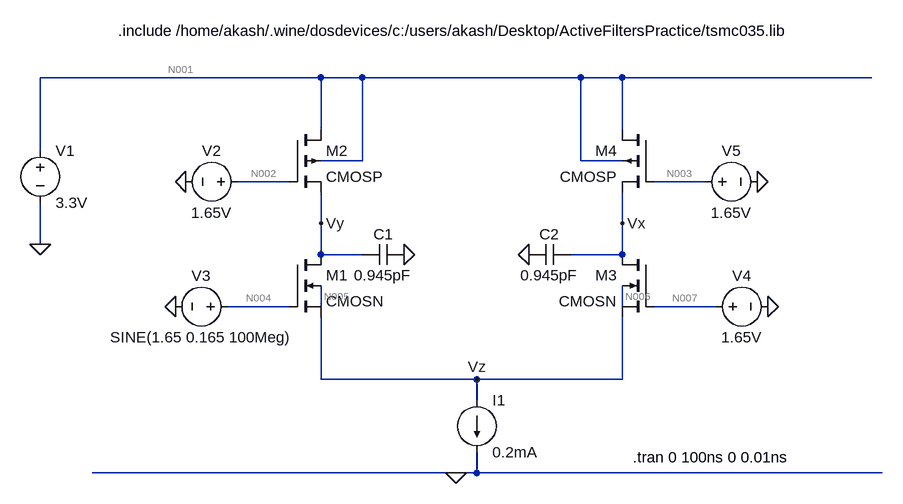
[diagram p0: schematic Draft1.asc]
Draft1.asc, the LTspice schematic file:
Version 4
SHEET 1 1084 724
WIRE 192 96 -240 96
WIRE 256 96 192 96
WIRE 592 96 256 96
WIRE 656 96 592 96
WIRE 1040 96 656 96
WIRE 192 176 192 96
WIRE 656 176 656 96
WIRE -240 208 -240 96
WIRE 256 224 256 96
WIRE 256 224 192 224
WIRE 592 224 592 96
WIRE 656 224 592 224
WIRE 144 256 64 256
WIRE 784 256 704 256
WIRE 192 320 192 272
WIRE 656 320 656 272
WIRE -240 352 -240 288
WIRE 192 368 192 320
WIRE 256 368 192 368
WIRE 656 368 656 320
WIRE 656 368 576 368
WIRE 144 448 48 448
WIRE 192 448 192 416
WIRE 656 448 656 416
WIRE 800 448 704 448
WIRE 192 560 192 464
WIRE 432 560 192 560
WIRE 656 560 656 464
WIRE 656 560 432 560
WIRE 432 592 432 560
WIRE 400 704 -160 704
WIRE 432 704 432 672
WIRE 432 704 400 704
WIRE 1056 704 432 704
FLAG -240 352 0
FLAG -32 448 0
FLAG 400 704 0
FLAG -16 256 0
FLAG 192 320 Vy
FLAG 880 448 0
FLAG 864 256 0
FLAG 656 320 Vx
FLAG 432 560 Vz
FLAG 320 368 0
FLAG 512 368 0
SYMBOL voltage -240 192 R0
SYMATTR InstName V1
SYMATTR Value 3.3V
SYMBOL nmos4 144 368 R0
SYMATTR InstName M1
SYMATTR Value CMOSN
SYMATTR Value2 l=0.5u w=80u
SYMBOL voltage 64 448 R90
WINDOW 0 -32 56 VBottom 2
WINDOW 3 32 56 VTop 2
WINDOW 123 60 56 VTop 2
WINDOW 39 0 0 Left 0
SYMATTR InstName V3
SYMATTR Value SINE(1.65 0.165 100Meg)
SYMBOL pmos4 144 176 R0
SYMATTR InstName M2
SYMATTR Value CMOSP
SYMATTR Value2 l=0.5u w=8.3u
SYMBOL voltage 80 256 R90
WINDOW 0 -32 56 VBottom 2
WINDOW 3 32 56 VTop 2
WINDOW 123 0 0 Left 0
WINDOW 39 0 0 Left 0
SYMATTR InstName V2
SYMATTR Value 1.65V
SYMBOL nmos4 704 368 M0
SYMATTR InstName M3
SYMATTR Value CMOSN
SYMATTR Value2 l=0.5u w=80u
SYMBOL voltage 784 448 M90
WINDOW 0 -32 56 VBottom 2
WINDOW 3 32 56 VTop 2
WINDOW 123 0 0 Left 0
WINDOW 39 0 0 Left 0
SYMATTR InstName V4
SYMATTR Value 1.65V
SYMBOL pmos4 704 176 M0
SYMATTR InstName M4
SYMATTR Value CMOSP
SYMATTR Value2 l=0.5u w=8.3u
SYMBOL voltage 768 256 M90
WINDOW 0 -32 56 VBottom 2
WINDOW 3 32 56 VTop 2
WINDOW 123 0 0 Left 0
WINDOW 39 0 0 Left 0
SYMATTR InstName V5
SYMATTR Value 1.65V
SYMBOL current 432 592 R0
WINDOW 123 0 0 Left 0
WINDOW 39 0 0 Left 0
SYMATTR InstName I1
SYMATTR Value 0.2mA
SYMBOL cap 320 352 R90
WINDOW 0 0 32 VBottom 2
WINDOW 3 32 32 VTop 2
SYMATTR InstName C1
SYMATTR Value 0.945pF
SYMBOL cap 576 352 R90
WINDOW 0 0 32 VBottom 2
WINDOW 3 32 32 VTop 2
SYMATTR InstName C2
SYMATTR Value 0.945pF
TEXT -120 24 Left 2 !.include /home/akash/.wine/dosdevices/c:/users/akash/Desktop/ActiveFiltersPractice/tsmc035.lib
TEXT 672 680 Left 2 !.tran 0 100ns 0 0.01ns

The netlist it stands for:
* Draft1.asc
V1 N001 0 3.3V
M1 Vy N004 Vz N005 CMOSN l=0.5u w=80u
V3 N004 0 SINE(1.65 0.165 100Meg)
M2 N001 N002 Vy N001 CMOSP l=0.5u w=8.3u
V2 N002 0 1.65V
M3 Vx N007 Vz N006 CMOSN l=0.5u w=80u
V4 N007 0 1.65V
M4 N001 N003 Vx N001 CMOSP l=0.5u w=8.3u
V5 N003 0 1.65V
I1 Vz 0 0.2mA
C1 0 Vy 0.945pF
C2 Vx 0 0.945pF
.model NMOS NMOS
.model PMOS PMOS
.lib standard.mos
.include /home/akash/.wine/dosdevices/c:/users/akash/Desktop/ActiveFiltersPractice/tsmc035.lib
.tran 0 100ns 0 0.01ns
.backanno
.end

* Results of the author's LTspice run, read from the files saved beside the schematic
* Operating Point, zero values left out:
*   V(n001) = 3.3 V
*   V(vy) = 1.637 V
*   V(n004) = 1.65 V
*   V(vz) = 543.9 mV
*   V(n005) = 632.3 mV
*   V(n002) = 1.65 V
*   V(vx) = 1.637 V
*   V(n007) = 1.65 V
*   V(n006) = 632.3 mV
*   V(n003) = 1.65 V
*   Id(M4) = 100 µA
*   Ib(M4) = 1.673 pA
*   Is(M4) = -100 µA
*   Id(M2) = 100 µA
*   Ib(M2) = 1.673 pA
*   Is(M2) = -100 µA
*   Id(M3) = 100 µA
*   Is(M3) = -100 µA
*   Id(M1) = 100 µA
*   Is(M1) = -100 µA
*   I(I1) = 200 µA
*   I(V1) = -200 µA
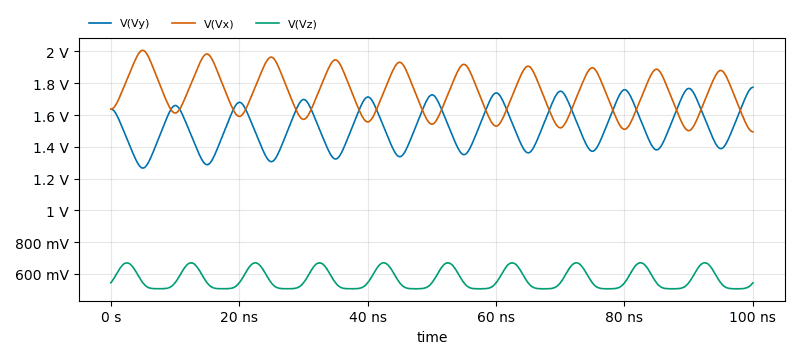
[diagram p1: Transient Analysis of Draft1.asc, plotted from the saved traces]
* Transient Analysis, 1 run:
*   V(Vy): min 1.266 V, max 1.775 V, average 1.527 V, rms 1.533 V, last 1.775 V
*   V(Vx): min 1.494 V, max 2.007 V, average 1.74 V, rms 1.745 V, last 1.494 V
*   V(Vz): min 506.5 mV, max 670.3 mV, average 566.7 mV, rms 569.9 mV, last 544 mV